# Altium schematic sheet Flash.SchDoc
size A; SheetNumber: 15; SheetTotal: 15
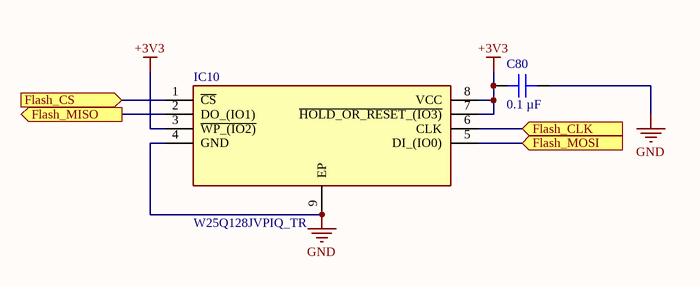
[diagram p0: Flash.SchDoc]

## Parts
C80  0.1 µF  [CAP 0402_1005]
IC10  W25Q128JVPIQ_TR  [SON127P600X500X80-9N-D]

## Ports
Flash_CLK (in), Flash_CS (in), Flash_MISO (out), Flash_MOSI (in)

## Nets
+3V3: C80.1 IC10.3(~{WP_(IO2)}) IC10.7(~{HOLD_OR_RESET_(IO3)}) IC10.8(VCC)
GND: C80.2 IC10.4(GND) IC10.9(EP)
Flash_CLK: IC10.6(CLK) ; port Flash_CLK
Flash_CS: IC10.1(~{CS}) ; port Flash_CS
Flash_MISO: IC10.2(DO_(IO1)) ; port Flash_MISO
Flash_MOSI: IC10.5(DI_(IO0)) ; port Flash_MOSI

## Library data of the parts
C80 = C0402C104K4RECAUTO: CAP CER 0402 0.1UF 16V X7R 10%; manufacturer: KEMET; Part Number: C0402C104K4RECAUTO; Capacitance: 0.1 µF; Applications: Automotive, ESD Protection; componentlink1description: Datasheet; componentlink1url: https://api.kemet.com/component-edge/download/datasheet/C0402C104K4RECAUTO.pdf; componentlink2description: DigiKey Link; componentlink2url: https://www.digikey.com/en/products/detail/kemet/C0402C104K4RECAUTO/8563695; Device Package: 0402 (1005 Metric); lastupdated: 2/9/2024 8:04:38 PM; Lifecycle Status: Active; Minimum Order: 1; Mounting Type: Surface Mount, MLCC; Operating Temperature: -55°C ~ 125°C; Package / Case: 0402 (1005 Metric); packaging: TapeAndReel; partid: 1731; Part Status: Active; price: 0.01; Ratings: AEC-Q200; series: ESD SMD Auto X7R; Size / Dimension: 0.039" L x 0.020" W (1.00mm x 0.50mm); Supplier 1: DigiKey; Supplier Part Number 1: 399-17167-1-ND; Temperature Coefficient: X7R; Thickness (Max): 0.022" (0.55mm); Tolerance: ±10%; value: 0.1 µF; Voltage - Rated: 16V
IC10 = W25Q128JVPIQ_TR: Integrated Circuit; Manufacturer_Name: Winbond; Manufacturer_Part_Number: W25Q128JVPIQ TR; Datasheet Link: https://www.winbond.com/resource-files/w25q128jv%20revf%2003272018%20plus.pdf; Height: 0.8mm; Mouser Part Number: 454-W25Q128JVPIQTR; Mouser Price/Stock: https://www.mouser.co.uk/ProductDetail/Winbond/W25Q128JVPIQ-TR?qs=qSfuJ%252Bfl%2Fd6H7vbXyrDu3w%3D%3D; Arrow Part Number: W25Q128JVPIQ TR; Arrow Price/Stock: https://www.arrow.com/en/products/w25q128jvpiqtr/winbond-electronics?utm_currency=USD&region=nac